# EAGLE design schematic_revision_1 (EAGLE 9.6.2)
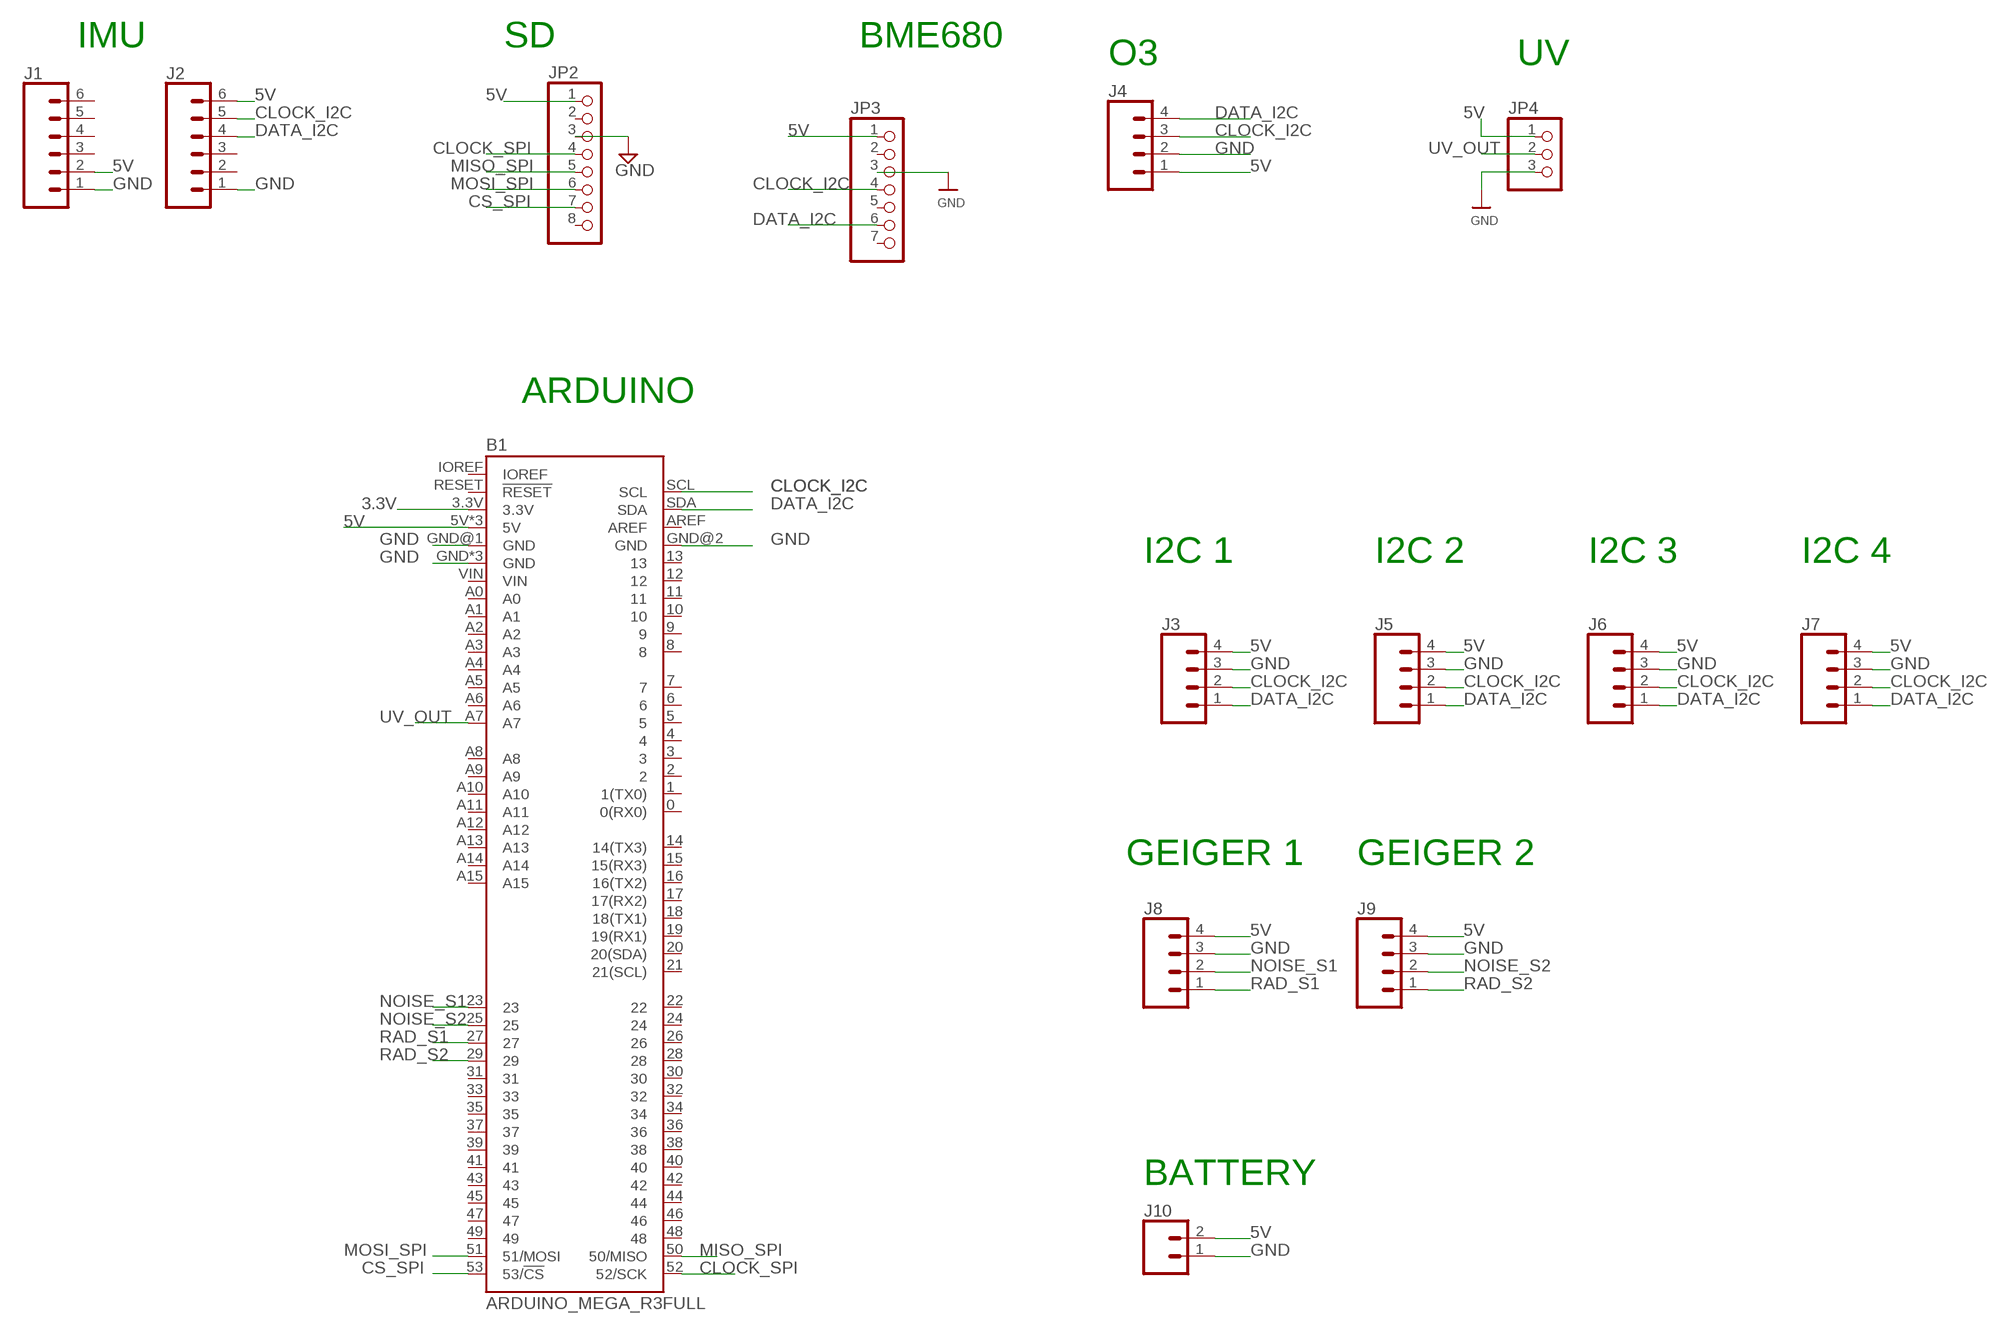
[diagram p0: schematic, sheet 1, part 1 of 2]
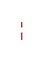
[diagram p1: schematic, sheet 1, part 2 of 2]

## Parts
B1  ARDUINO_MEGA_R3FULL  [ARDUINO_MEGA_NO_SILK]
J1  CONN_06NO_SILK_NO_POP  [1X06_NO_SILK]
J2  CONN_06NO_SILK_NO_POP  [1X06_NO_SILK]
J3  CONN_04PTH  [1X04]
J4  CONN_04LOCK  [1X04_LOCK]
J5  CONN_04PTH  [1X04]
J6  CONN_04PTH  [1X04]
J7  CONN_04PTH  [1X04]
J8  CONN_04PTH  [1X04]
J9  CONN_04PTH  [1X04]
J10  CONN_02  [1X02]
JP2  PINHD-1X8BIG  [1X08-BIG]
JP3  HEADER-1X770MIL  [1X07_ROUND_70]
JP4  PINHD-1X3CB  [1X03-CLEANBIG]

## Nets
3.3V [lowpower]: B1.3.3V
5V: B1.5V B1.5V@1(5V) B1.5V@2(5V) J1.2 J2.6 J3.4 J4.1 J5.4 J6.4 J7.4 J8.4 J9.4 J10.2 JP2.1 JP3.1 JP4.1
CLOCK_I2C: B1.SCL J2.5 J3.2 J4.3 J5.2 J6.2 J7.2 JP3.4
CLOCK_SPI: B1.52(52/SCK) JP2.4
CS_SPI: B1.53(53/!CS) JP2.7
DATA_I2C: B1.SDA J2.4 J3.1 J4.4 J5.1 J6.1 J7.1 JP3.6
GND [highpower]: B1.GND B1.GND@1(GND) B1.GND@2(GND) B1.GND@3(GND) B1.GND@4(GND) J1.1 J2.1 J3.3 J4.2 J5.3 J6.3 J7.3 J8.3 J9.3 J10.1 JP2.3 JP3.3 JP4.3
MISO_SPI: B1.50(50/MISO) JP2.5
MOSI_SPI: B1.51(51/MOSI) JP2.6
NOISE_S1: B1.23 J8.2
NOISE_S2: B1.25 J9.2
RAD_S1: B1.27 J8.1
RAD_S2: B1.29 J9.1
UV_OUT: B1.A7 JP4.2
Unconnected: B1.0(0(RX0)) B1.1(1(TX0)) B1.2 B1.3 B1.4 B1.5 B1.6 B1.7 B1.8 B1.9 B1.10 B1.11 B1.12 B1.13 B1.14(14(TX3)) B1.15(15(RX3)) B1.16(16(TX2)) B1.17(17(RX2)) B1.18(18(TX1)) B1.19(19(RX1)) B1.20(20(SDA)) B1.21(21(SCL)) B1.22 B1.24 B1.26 B1.28 B1.30 B1.31 B1.32 B1.33 B1.34 B1.35 B1.36 B1.37 B1.38 B1.39 B1.40 B1.41 B1.42 B1.43 B1.44 B1.45 B1.46 B1.47 B1.48 B1.49 B1.A0 B1.A1 B1.A2 B1.A3 B1.A4 B1.A5 B1.A6 B1.A8 B1.A9 B1.A10 B1.A11 B1.A12 B1.A13 B1.A14 B1.A15 B1.AREF B1.IOREF B1.RESET(!RESET) B1.VIN J1.3 J1.4 J1.5 J1.6 J2.2 J2.3 JP2.2 JP2.8 JP3.2 JP3.5 JP3.7

## Notes on the sheet
- IMU | SD | BME680
- O3 | UV
- ARDUINO
- I2C 1 | I2C 2 | I2C 3 | I2C 4
- GEIGER 1 | GEIGER 2
- BATTERY

## Library data of the parts
B1 = SparkFun-Boards:ARDUINO_MEGA_R3: Arduino Mega R3 ATmega2560 R3 compatible footprint. SparkFun Products: Arduino Mega 2560 R3 <https://www.sparkfun.com/products/11061>
J1 J2 = SparkFun-Connectors:CONN_06: Multi connection point. Often used as Generic Header-pin footprint for 0.1 inch spaced/style header connections On any of the 0.1 inch spaced packages, you can populate with these: Break Away Headers - Straight <https://www.sparkfun.com/products/116> (PRT-00116) Break Away Male Headers - Right Angle <https://www.sparkfun.com/products/553> (PRT-00553) Female Headers <https://www.sparkfun.com/products/115> (PRT-00115) Break Away Headers - Machine Pin <https://www.sparkfun.com/products/117> (PRT-00117) Break Away Female Headers - Swiss Machine Pin <https://www.sparkfun.com/products/743> (PRT-00743) Arduino Stackable Header - 6 Pin <https://www.sparkfun.com/products/9280> (PRT-09280) For SCREWTERMINALS and SPRING TERMINALS visit here: Screw Terimnals on SparkFun.com <https://www.sparkfun.com/search/results?term=Screw+Terminals> (5mm/3.5mm/2.54mm spacing) This device is also useful as a general connection point to wire up your design to another part of your project. Our various solder wires solder well into these plated through hole pads. Hook-Up Wire - Assortment (Stranded, 22 AWG) <https://www.sparkfun.com/products/11375> (PRT-11375) Hook-Up Wire - Assortment (Solid Core, 22 AWG) <https://www.sparkfun.com/products/11367> (PRT-11367) View the entire wire category on our website here <https://www.sparkfun.com/categories/141>
J3-J9 = SparkFun-Connectors:CONN_04: Multi connection point. Often used as Generic Header-pin footprint for 0.1 inch spaced/style header connections On any of the 0.1 inch spaced packages, you can populate with these: Break Away Headers - Straight <https://www.sparkfun.com/products/116> (PRT-00116) Break Away Male Headers - Right Angle <https://www.sparkfun.com/products/553> (PRT-00553) Female Headers <https://www.sparkfun.com/products/115> (PRT-00115) Break Away Headers - Machine Pin <https://www.sparkfun.com/products/117> (PRT-00117) Break Away Female Headers - Swiss Machine Pin <https://www.sparkfun.com/products/743> (PRT-00743) For SCREWTERMINALS and SPRING TERMINALS visit here: Screw Terimnals on SparkFun.com <https://www.sparkfun.com/search/results?term=Screw+Terminals> (5mm/3.5mm/2.54mm spacing) This device is also useful as a general connection point to wire up your design to another part of your project. Our various solder wires solder well into these plated through hole pads. Hook-Up Wire - Assortment (Stranded, 22 AWG) <https://www.sparkfun.com/products/11375> (PRT-11375) Hook-Up Wire - Assortment (Solid Core, 22 AWG) <https://www.sparkfun.com/products/11367> (PRT-11367) View the entire wire category on our website here <https://www.sparkfun.com/categories/141> Special notes: Molex polarized connector foot print use with SKU : PRT-08231 with associated crimp pins and housings. 1MM SMD Version SKU: PRT-10208; PROD_ID: CONN-09696
J10 = SparkFun-Connectors:CONN_02: Multi connection point. Often used as Generic Header-pin footprint for 0.1 inch spaced/style header connections On any of the 0.1 inch spaced packages, you can populate with these: Break Away Headers - Straight <https://www.sparkfun.com/products/116> (PRT-00116) Break Away Male Headers - Right Angle <https://www.sparkfun.com/products/553> (PRT-00553) Female Headers <https://www.sparkfun.com/products/115> (PRT-00115) Break Away Headers - Machine Pin <https://www.sparkfun.com/products/117> (PRT-00117) Break Away Female Headers - Swiss Machine Pin <https://www.sparkfun.com/products/743> (PRT-00743) For SCREWTERMINALS and SPRING TERMINALS visit here: Screw Terimnals on SparkFun.com <https://www.sparkfun.com/search/results?term=Screw+Terminals> (5mm/3.5mm/2.54mm spacing) This device is also useful as a general connection point to wire up your design to another part of your project. Our various solder wires solder well into these plated through hole pads. Hook-Up Wire - Assortment (Stranded, 22 AWG) <https://www.sparkfun.com/products/11375> (PRT-11375) Hook-Up Wire - Assortment (Solid Core, 22 AWG) <https://www.sparkfun.com/products/11367> (PRT-11367) View the entire wire category on our website here <https://www.sparkfun.com/categories/141> Special notes: Molex polarized connector foot print use with: PRT-08233 with associated crimp pins and housings. 2.54_SCREWTERM for use with PRT-10571. 3.5mm Screw Terminal footprints for PRT-08084 5mm Screw Terminal footprints for use with PRT-08432
JP2 = adafruit:PINHD-1X8: PIN HEADER
JP3 = microbuilder:HEADER-1X7: PIN HEADER
JP4 = adafruit:PINHD-1X3: PIN HEADER

## Net classes
1 highpower: width 0.305 mm, drill 0.483 mm
2 lowpower: width 0.305 mm, drill 0.483 mm

## Board
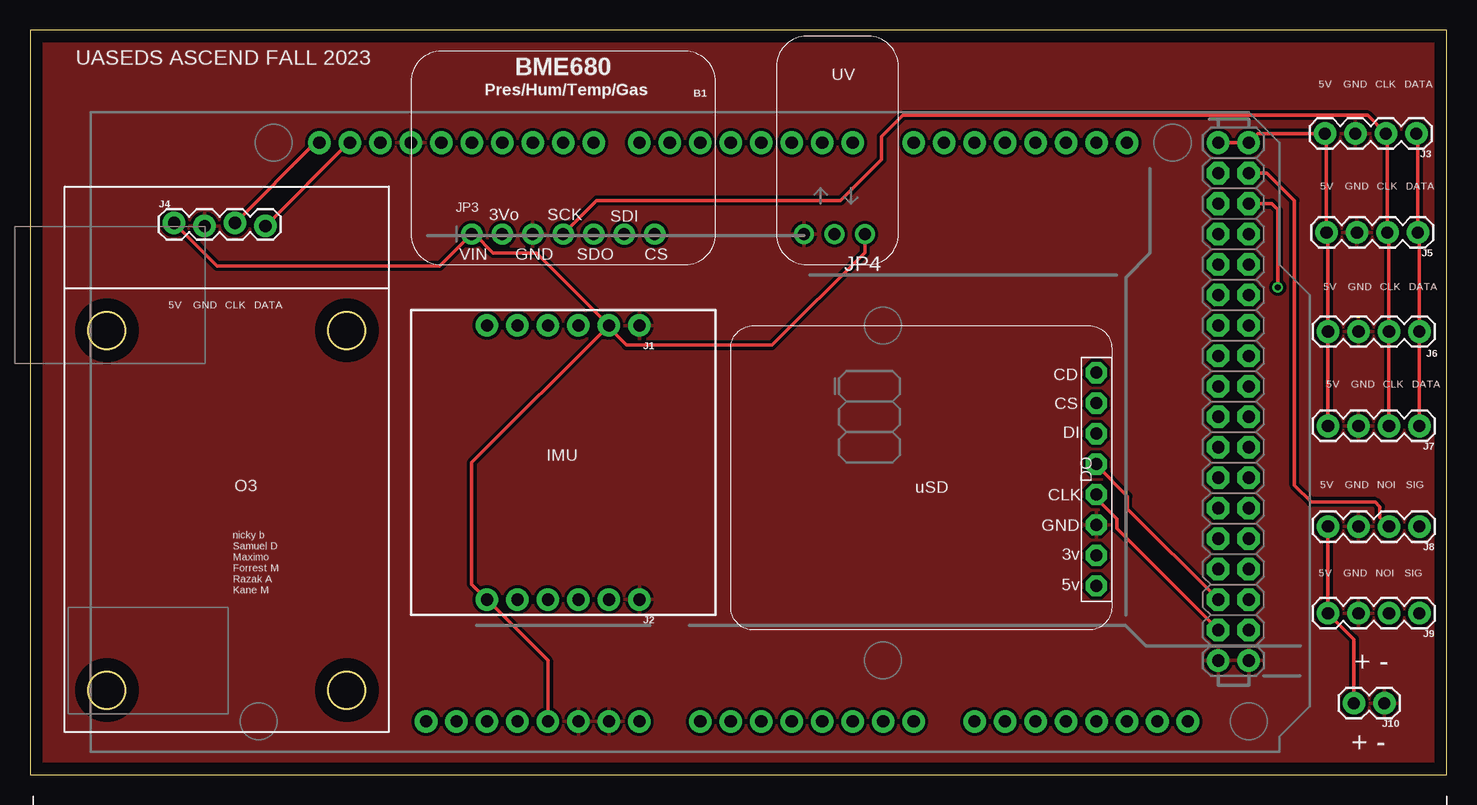
[diagram p2: board, top side]
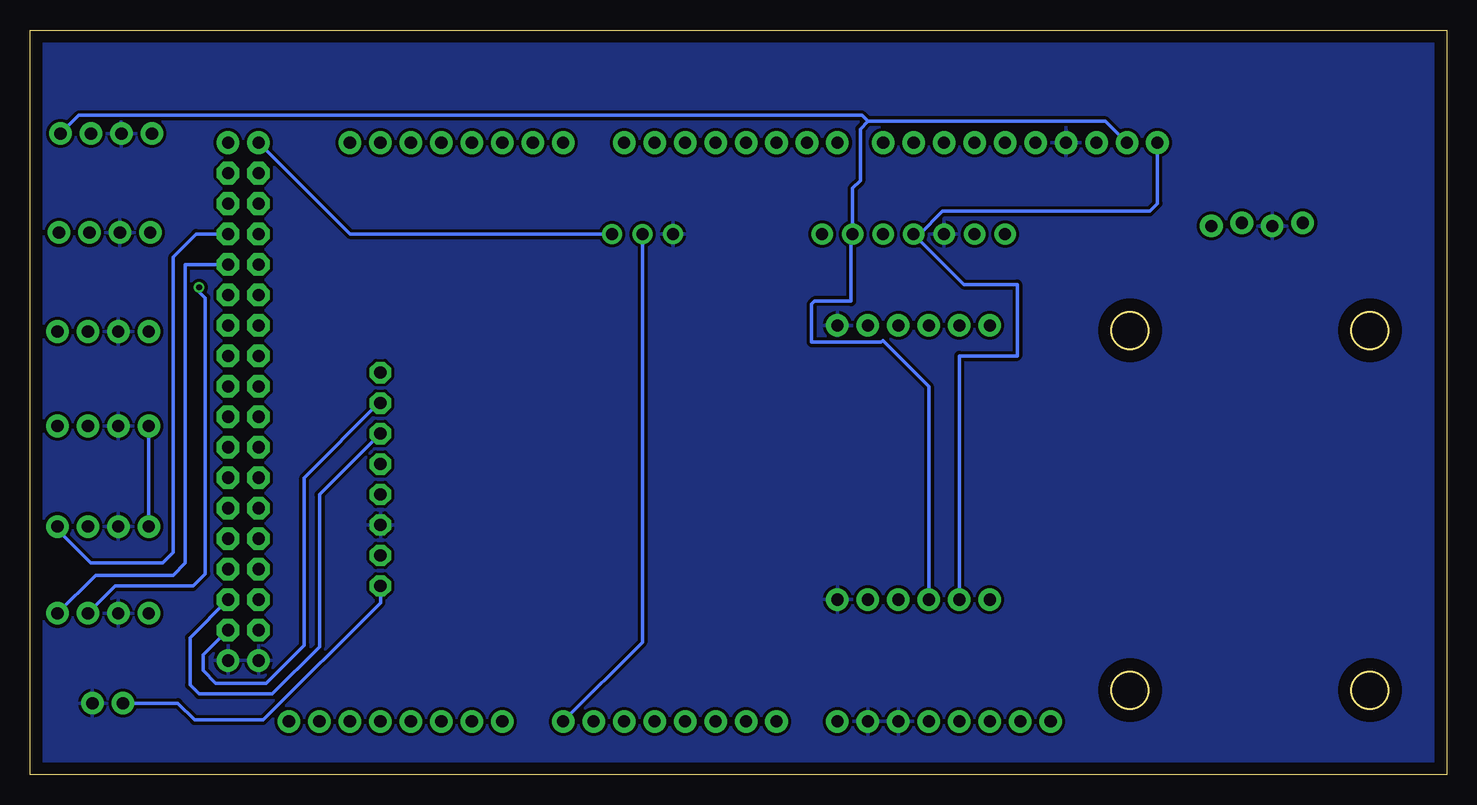
[diagram p3: board, bottom side, seen from below]

Size 118.11 x 62.1 mm. Coordinates in mm from the lower left corner, seen from the top.
Outline: 0,0 118.11,0 118.11,62.1 0,62.1 0,0
Outline: circle at 6.41,37.05 radius 1.55
Outline: circle at 6.41,7.04 radius 1.55
Outline: circle at 26.41,37.05 radius 1.55
Outline: circle at 26.41,7.04 radius 1.55
Copper layers (1*16): Top 0.035mm / dielectric 1.5mm / Bottom 0.035mm
Design rules "default *": minimum track width 6mil, minimum drill 0.35mm, track to track 10mil, track to pad 10mil, pad to pad 10mil, via to via 10mil, smd to smd 6mil, copper to edge 40mil, drill to drill 6mil, minimum pad ring 10mil, minimum via ring 8mil, stop-mask expansion 4mil, vias tented up to drill 0mil, thermal gap 10mil

### Footprints (pad centres in the part's own frame; a part is rotated, then mirrored left to right if it is on the bottom)
ARDUINO_MEGA_NO_SILK = drill 1.016 pad 1.88: 0 13.97,24.13; 1 11.43,24.13; 2 8.89,24.13; 3 6.35,24.13; 3.3V -13.97,-24.13; 4 3.81,24.13; 5 1.27,24.13; 5V -11.43,-24.13; 5V@1 44.45,24.13; 5V@2 46.99,24.13; 6 -1.27,24.13; 7 -3.81,24.13; 8 -7.62,24.13; 9 -10.16,24.13; 10 -12.7,24.13; 11 -15.24,24.13; 12 -17.78,24.13; 13 -20.32,24.13; 14 19.05,24.13; 15 21.59,24.13; 16 24.13,24.13; 17 26.67,24.13; 18 29.21,24.13; 19 31.75,24.13; 20 34.29,24.13; 21 36.83,24.13; A0 1.27,-24.13; A1 3.81,-24.13; A2 6.35,-24.13; A3 8.89,-24.13; A4 11.43,-24.13; A5 13.97,-24.13; A6 16.51,-24.13; A7 19.05,-24.13; A8 24.13,-24.13; A9 26.67,-24.13; A10 29.21,-24.13; A11 31.75,-24.13; A12 34.29,-24.13; A13 36.83,-24.13; A14 39.37,-24.13; A15 41.91,-24.13; AREF -25.4,24.13; GND -8.89,-24.13; GND@1 -6.35,-24.13; GND@2 44.45,-19.05; GND@3 46.99,-19.05; GND@4 -22.86,24.13; IOREF -19.05,-24.13; NC -21.59,-24.13; RESET -16.51,-24.13; SCL -30.48,24.13; SDA -27.94,24.13; VIN -3.81,-24.13 | drill 1.016 pad 1.88 octagon: 22 44.45,21.59; 23 46.99,21.59; 24 44.45,19.05; 25 46.99,19.05; 26 44.45,16.51; 27 46.99,16.51; 28 44.45,13.97; 29 46.99,13.97; 30 44.45,11.43; 31 46.99,11.43; 32 44.45,8.89; 33 46.99,8.89; 34 44.45,6.35; 35 46.99,6.35; 36 44.45,3.81; 37 46.99,3.81; 38 44.45,1.27; 39 46.99,1.27; 40 44.45,-1.27; 41 46.99,-1.27; 42 44.45,-3.81; 43 46.99,-3.81; 44 44.45,-6.35; 45 46.99,-6.35; 46 44.45,-8.89; 47 46.99,-8.89; 48 44.45,-11.43; 49 46.99,-11.43; 50 44.45,-13.97; 51 46.99,-13.97; 52 44.45,-16.51; 53 46.99,-16.51
1X06_NO_SILK = drill 1.016 pad 1.88: 1 0,0; 2 2.54,0; 3 5.08,0; 4 7.62,0; 5 10.16,0; 6 12.7,0
1X04 = drill 1.016 pad 1.88: 1 0,0; 2 2.54,0; 3 5.08,0; 4 7.62,0
1X04_LOCK = drill 1.016 pad 1.88: 1 0,0.127; 2 2.54,-0.127; 3 5.08,0.127; 4 7.62,-0.127
1X02 = drill 1.016 pad 1.88: 1 0,0; 2 2.54,0
1X08-BIG = drill 1.016 pad 1.778 octagon: 1 -8.89,0; 2 -6.35,0; 3 -3.81,0; 4 -1.27,0; 5 1.27,0; 6 3.81,0; 7 6.35,0; 8 8.89,0
1X07_ROUND_70 = drill 1 pad 1.778: 1 -7.62,0; 2 -5.08,0; 3 -2.54,0; 4 0,0; 5 2.54,0; 6 5.08,0; 7 7.62,0
1X03-CLEANBIG = drill 1.016 pad 1.676: 1 -2.54,0; 2 0,0; 3 2.54,0

### Placement (x,y rotation side)
B1  54.61,28.57 0 top
J1  50.8,37.47 180 top
J2  50.8,14.61 180 top
J3  115.57,53.47 180 top
J4  12.01,45.89 0 top
J5  115.7,45.21 180 top
J6  115.82,36.96 180 top
J7  115.82,29.08 180 top
J8  115.82,20.7 180 top
J9  115.82,13.46 180 top
J10  112.9,5.97 180 top
JP2  88.9,24.64 90 top
JP3  44.45,45.08 0 top
JP4  67.06,45.08 180 top

### Tracks (layer width: path | path; a pad name or v marks a point on that pad's centre or on a via)
5V
  Top 0.305: B1.5V 43.18,9.53 J2.6 36.83,15.88 36.83,26.04 J1.2 | J7.4 J6.4 108.2,45.08 J5.4 108.08,53.34 J3.4 102.36,53.47 B1.5V@2 B1.5V@1 | J8.4 J9.4 110.36,11.3 J10.2 | J1.2 42.21,43.51 38.62,43.51 37.05,45.08 JP3.1 34.16,42.42 15.6,42.42 J4.1 | J1.2 48.26,37.27 49.72,35.81 61.85,35.81 69.6,43.56 JP4.1
  Bottom 0.305: J7.4 J8.4 | B1.5V@1 91.44,45.08 JP4.1 | JP2.1 88.9,14.35 98.68,4.57 104.39,4.57 105.79,5.97 J10.2
CLOCK_I2C
  Top 0.305: J7.2 J6.2 113.28,45.08 J5.2 113.16,53.34 J3.2 111.51,54.99 72.77,54.99 70.99,53.21 70.99,51.31 67.56,47.88 47.24,47.88 JP3.4 | J4.3 23.78,52.7 B1.SCL
  Bottom 0.305: B1.SCL 24.13,47.62 24.77,46.99 42.04,46.99 43.94,45.08 JP3.4 40.26,40.89 35.81,40.89 35.81,34.92 40.64,34.92 J2.5
CLOCK_SPI
  Top 0.305: B1.52 90.6,20.52 90.6,21.32 88.9,23.02 JP2.4
CS_SPI
  Bottom 0.305: B1.53 103.68,9.98 103.68,8.69 102.62,7.62 98.44,7.62 95.25,10.81 95.25,24.77 89.03,30.99 JP2.7
DATA_I2C
  Top 0.305: J3.1 115.7,53.34 J5.1 115.82,45.08 J6.1 J7.1 | J4.4 26.58,52.7 B1.SDA
  Bottom 0.305: J2.4 43.18,32.39 47.02,36.22 47.17,36.07 52.96,36.07 52.96,39.24 52.7,39.5 49.66,39.5 49.66,44.96 JP3.6 49.53,48.89 48.89,49.53 48.89,53.85 48.26,54.48 | B1.SDA 28.45,54.48 48.26,54.48 | J3.1 114.05,54.99 48.77,54.99 48.26,54.48
GND
  pour Top: 0.38,61.72 117.6,61.72 117.6,0.51 0.38,0.51
  pour Bottom: 0.38,61.72 117.6,61.72 117.6,0.51 0.38,0.51
MISO_SPI
  Top 0.305: B1.50 91.49,22.17 91.49,23.23 88.9,25.82 JP2.5
MOSI_SPI
  Bottom 0.305: JP2.6 93.98,23.37 93.98,10.67 97.92,6.73 104.01,6.73 104.77,7.49 104.77,11.43 B1.51
NOISE_S1
  Top 0.305: B1.23 103.12,50.17 105.41,47.88 105.41,24.13 106.81,22.73 112.14,22.73 112.52,22.35 112.52,21.46 J8.2
NOISE_S2  (via drill 0.48)
  Top 0.305: B1.25 103.5,47.62 104.01,47.12 v104.01,40.64
  Bottom 0.305: v104.01,40.64 104.01,40.26 103.5,39.75 103.5,16.76 104.52,15.75 111,15.75 J9.2
RAD_S1
  Bottom 0.305: B1.27 104.27,45.08 106.17,43.18 106.17,18.54 107.06,17.65 113.03,17.65 115.82,20.45 J8.1
RAD_S2
  Bottom 0.305: B1.29 105.16,42.55 105.16,17.65 106.17,16.64 112.65,16.64 J9.1
UV_OUT
  Bottom 0.305: JP4.2 67.06,11.05 B1.A7

### Text on the board
tPlace: UASEDS ASCEND FALL 2023 | BME680 | UV | Pres/Hum/Temp/Gas | 5V | GND | CLK | DATA | 5V | GND | CLK | DATA | 3Vo | SCK | SDI | VIN | GND | SDO | CS | 5V | GND | CLK | DATA | 5V | GND | CLK | DATA | 5V | GND | CLK | DATA | IMU | 5V | GND | NOI | SIG | O3 | uSD | 5V | GND | NOI | SIG | nicky b / Samuel D / Maximo / Forrest M / Razak A / Kane M | + - | + -
tNames: CD | CS | DI | DO | CLK | GND | 3v | 5v